# Altium schematic sheet SchemaMicro.SchDoc
size A4; SheetNumber: 1; SheetTotal: 2
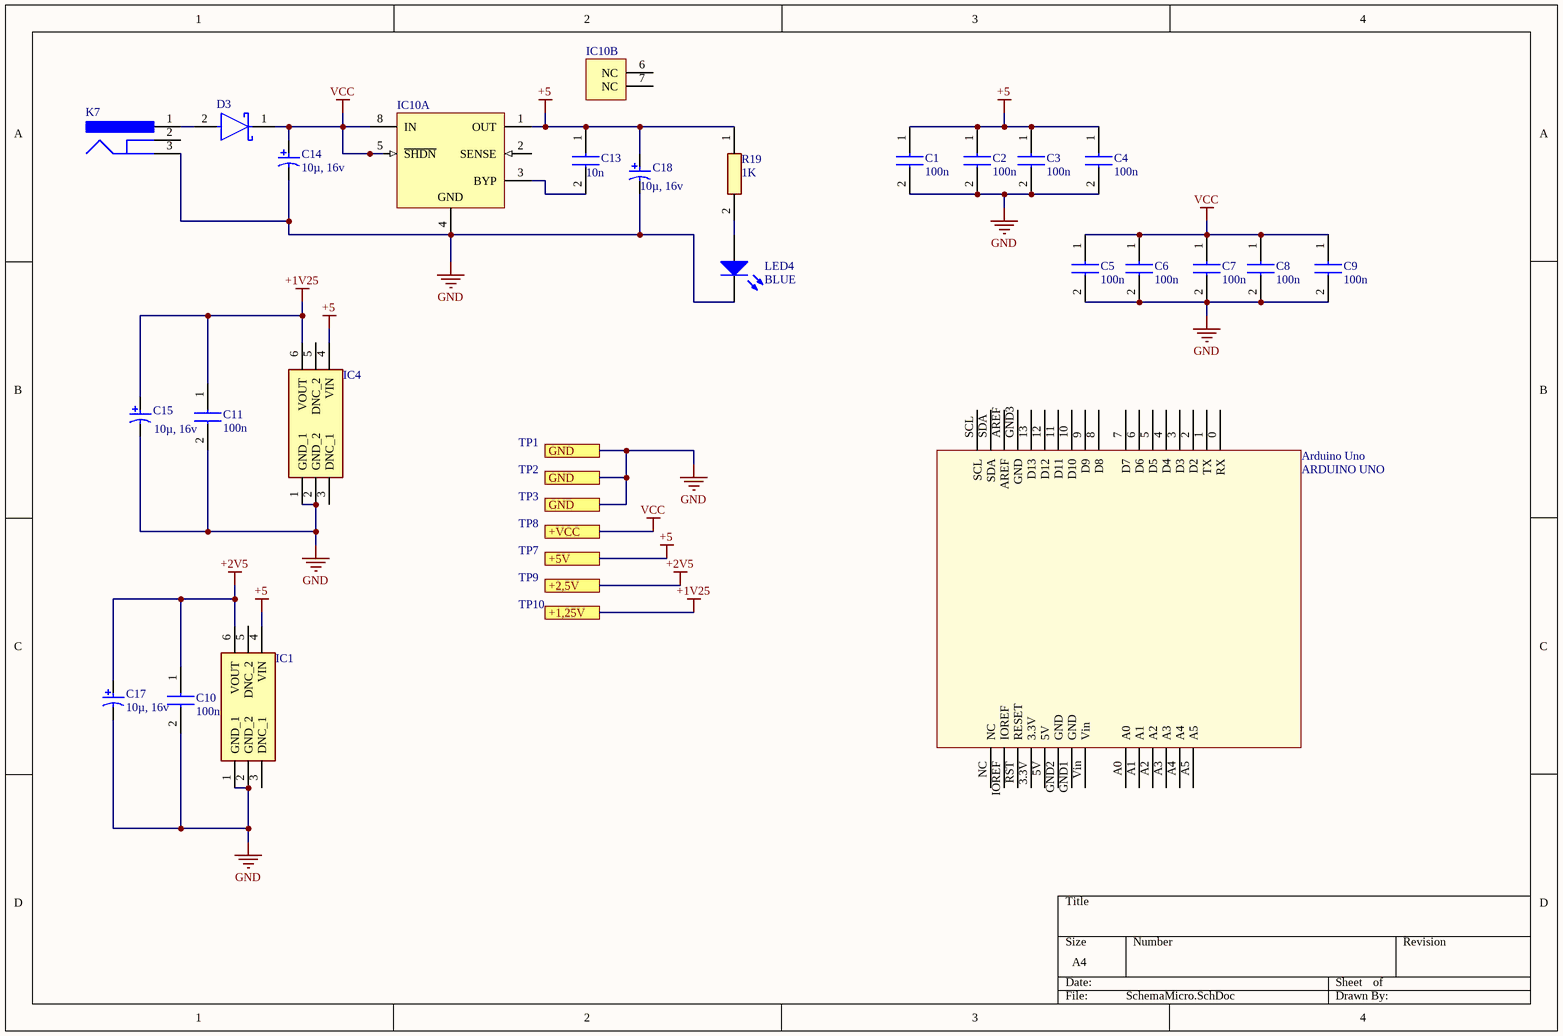
[diagram p0: SchemaMicro.SchDoc]

## Parts
Arduino_Uno  ARDUINO UNO  [ARDUINO UNO]
C1  100n  [CAPC2012X90N]
C2  100n  [CAPC2012X90N]
C3  100n  [CAPC2012X90N]
C4  100n  [CAPC2012X90N]
C5  100n  [CAPC2012X90N]
C6  100n  [CAPC2012X90N]
C7  100n  [CAPC2012X90N]
C8  100n  [CAPC2012X90N]
C9  100n  [CAPC2012X90N]
C10  100n  [CAPC2012X90N]
C11  100n  [CAPC2012X90N]
C13  10n  [CAPC2012X90N]
C14  10µ, 16v  [KEMT-T491-B_L]
C15  10µ, 16v  [KEMT-T491-B_L]
C17  10µ, 16v  [KEMT-T491-B_L]
C18  10µ, 16v  [KEMT-T491-B_L]
D3  (no value)  [FP-SOD123-IPC_A]
IC1  (no value)  [SOT95P280X100-6N]
IC4  (no value)  [LT1790BCS6125TRMPBF]
IC10  (no value)  [LT-MS8_N]  (parts A,B of 2)
K7  (no value)  [LUMB-NEB21R_V]
LED4  BLUE  [1206_A]
R19  1K  [RESC2014X65N]

## Ports
+1,25V, +2,5V, +5V, +VCC, GND

## Nets
+1V25: C11.1 C15.1 IC4.6(VOUT) ; port +1,25V
+2V5: C10.1 C17.1 IC1.6(VOUT) ; port +2,5V
+5: C1.1 C2.1 C3.1 C4.1 C13.1 C18.1 IC1.4(VIN) IC4.4(VIN) IC10.1(OUT) R19.1 ; port +5V
GND: C1.2 C2.2 C3.2 C4.2 C5.2 C6.2 C7.2 C8.2 C9.2 C10.2 C11.2 C14.2 C15.2 C17.2 C18.2 IC1.1(GND_1) IC1.2(GND_2) IC4.1(GND_1) IC4.2(GND_2) IC10.4(GND) K7.3 LED4.1(K) ; port GND
VCC: C5.1 C6.1 C7.1 C8.1 C9.1 C14.1 D3.1(C) IC10.5(~{SHDN}) IC10.8(IN) ; port +VCC
NetC13_2: C13.2 IC10.3(BYP)
NetD3_2: D3.2(A) K7.1
NetLED4_2: LED4.2(A) R19.2

Not connected (* = marked no-connect by the designer): Arduino_Uno 0(RX) 1(TX) 2(D2) 3(D3) 3.3V 4(D4) 5(D5) 5V 6(D6) 7(D7) 8(D8) 9(D9) 10(D10) 11(D11) 12(D12) 13(D13) A0 A1 A2 A3 A4 A5 AREF GND1(GND) GND2(GND) GND3(GND) IOREF NC RST(RESET) SCL SDA Vin; IC1 3(DNC_1) 5(DNC_2); IC4 3(DNC_1) 5(DNC_2); IC10 2(SENSE) 6(NC) 7(NC); K7 2

## Notes on the sheet
- TP1
- TP2
- TP3
- TP8
- TP9
- TP7
- TP10

## Library data of the parts
C1-C11 = MC0805B104K500CT: Capacitor; Manufacturer_Name: MULTICOMP; Datasheet Link: https://componentsearchengine.com/Datasheets/2/MC0805B104K500CT.pdf; Height: 0.9mm; Manufacturer_Part_Number: MC0805B104K500CT
C13 = MC0805N102J500CT: Capacitor; Manufacturer_Name: MULTICOMP; Datasheet Link: http://www.farnell.com/datasheets/1901289.pdf; Height: 0.9mm; Manufacturer_Part_Number: MC0805N102J500CT
C14 C15 C17 C18 = CMP-2000-07192-1: Tantalum Surface Mount Capacitor, 10 uF, +/- 20%, 16 V, -55 to 125 degC, 2-Pin SMD, RoHS, Tape and Reel; Manufacturer: Kemet; DF: 6%; Product Diameter (mm): NotRequiredmm; ESR: 2.8ohm; Capacitance: 10000000pF; Insulation: NotRequired; Rad Hardened: No; Polarity: Polar; Case Style: Molded; Product Depth (mm): 2.8mm; Product Length (mm): 3.5mm; Voltage: 16VDC; DCL: 1.6uA; Product Height (mm): 1.9mm; Mounting Technology: SurfaceMount; Package Reference: T491-B; Datasheet URL: http://www.kemet.com/Lists/ProductCatalog/Attachments/254/KEM_T2005_T491.pdf; Construction: SMTChip; Package / Case: 3528-21; Length W/Weld: NotRequiredmm; Seated Plane Height: NotRequiredmm; Datasheet Version: 06/2016; Seal: NotRequired; Mounting Style: SurfaceMount; Failure Rate: NotRequired; Operating Temp Range: -55Cto125C; Manufacturer URL: http://www.kemet.com/; Tolerance (+ or -): 20%; Case Code: B; Packaging: TapeandReel; Lead Spacing (nom): NotRequiredmm; Length W/Weld (max): NotRequiredmm; Package Description: 2-Pin Surface Mount Device, Body 3.5 x 2.8 mm; Wire Form: NotRequired
D3 = CMP-0303-00003-3: DIODE SCHOTTKY 40V 1A SOD123; Forward Voltage: 450mV; Capacitance: 110pF; Max Forward Surge Current (Ifsm): 25A; Peak Reverse Current: 50uA; Polarity: Standard; Element Configuration: Single; Max Power Dissipation: 450mW; Min Operating Temperature: -65°C; Package Quantity: 3000; Contact Plating: Tin; Weight: 0.000353oz; Max Repetitive Reverse Voltage (Vrrm): 40V; Max Reverse Voltage (DC): 40V; Height: 1.25mm; Average Rectified Current: 1A; Width: 1.7mm; Case/Package: SOD-123-2; Lead Free: Lead Free; Max Operating Temperature: 125°C; Current Rating: 1A; Termination: SMD/SMT; Forward Current: 1A; Radiation Hardening: No; Number of Pins: 2; Length: 2.85mm; Voltage Rating (DC): 40V; REACH SVHC: No SVHC; Peak Non-Repetitive Surge Current: 25A; Packaging: Tape and Reel; Output Current: 1A
IC1 = LT1790ACS6-2.048: Integrated Circuit; Manufacturer_Name: Linear Technology; Datasheet Link: http://docs-emea.rs-online.com/webdocs/05ab/0900766b805ab5c8.pdf; Height: 1mm; Manufacturer_Part_Number: LT1790ACS6-2.048
IC4 = LT1790BCS6-1.25#TRMPBF: Integrated Circuit; Manufacturer_Name: Analog Devices; Datasheet Link: https://www.arrow.com/en/products/lt1790bcs6-1.25trmpbf/analog-devices; Height: 1mm; Manufacturer_Part_Number: LT1790BCS6-1.25#TRMPBF; Mouser Part Number: 584-1790BCS61.25TMPF; Mouser Price/Stock: https://www.mouser.co.uk/ProductDetail/Analog-Devices/LT1790BCS6-125TRMPBF/?qs=ytflclh7QUXpPD13KZ8jjg%3D%3D; Arrow Part Number: LT1790BCS6-1.25#TRMPBF; Arrow Price/Stock: https://www.arrow.com/en/products/lt1790bcs6-1.25trmpbf/analog-devices
IC10 = CMP-0476-00707-1: 150 mA, Low Noise, LDO Micropower Regulator, 1.8 to 20 V Vin, 5 V Vout, 8-pin SOP (MS8-8), -40 to 125 degC, Pb-Free; Manufacturer: Linear Technology; PartNumber: LT1762EMS8-5#PBF; Iout(mA): 150; Output Voltage: 5 V; Isupply(mA): 0.025; Noise(uV): 20; Number of Outputs: 1; PSRR(dB): 65; Vin Min(V): 1.8; Dropout Voltage(V): 0.27; Discrete Pass Element: no; Mounting Technology: Surface Mount; ComponentLink3URL: http://cds.linear.com/docs/en/packaging/05081660_G_MS8.pdf; DatasheetVersion: Rev. A; PackageDescription: 8-Pin Plastic MSOP, Body 3 x 3 mm, Pitch 0.65 mm; RoHS: TRUE; ComponentLink2URL: http://cds.linear.com/docs/en/datasheet/1762fa.pdf; PackageReference: MS8; PackageVersion: Rev. G, 05/2013; ComponentLink2Description: Datasheet; ComponentLink3Description: Package Specification; ComponentLink1Description: Manufacturer URL; Shutdown Current(uA): 1; Vin Max(V): 20; ComponentLink1URL: http://www.linear.com/
K7 = CMP-2000-06841-1: Jack Socket, Body 14.5 x 9 mm, Height 11 mm, -20 to 70 degC, 3-Pin THD, RoHS, Bulk; Manufacturer: Lumberg; Body Orientation: RightAngle; Voltage Rating: 12Vdc; Current Rating: 3A; Maximum Operating Temperature: +70°C; Mounting Technology: ThroughHole; Termination Method: Solder; Package Description: 3-Pin Through Hole Device, Body 14.5 x 9 mm, Height 11 mm; Datasheet URL: https://datasheet.ciiva.com/11720/0900766b805694d6-11720273.pdf; Datasheet Version: 12/2004; Package Reference: NEB21R; Manufacturer URL: http://www.lumberg.com/; Plug/Socket: Socket; Mounting Type: ThroughHole; Minimum Operating Temperature: -20°C
LED4 = CMP-1426-00015-1: SMD mono-color Chip LED, WL-SMCW, Blue; Manufacturer: Wuerth Elektronik; PartNumber: 150120BS75000; ComponentLink2Description: Datasheet; ComponentLink1URL: http://www.we-online.com; ComponentLink1Description: Manufacturer URL; ComponentLink2URL: http://katalog.we-online.com/led/datasheet/150120BS75000.pdf; PackageReference: 1206_A; Color: Blue
R19 = MC01W080551K: Resistor 1K ohm; Manufacturer_Name: MULTICOMP; Datasheet Link: http://www.farnell.com/datasheets/1729047.pdf; Height: 0.65mm; Manufacturer_Part_Number: MC01W080551K